# Altium schematic sheet H-00488 - Connectors Downstream.SchDoc: Connectors Downstream
size 403 x 281 mm; DocumentNumber: 12; SheetNumber: 12; SheetTotal: 12
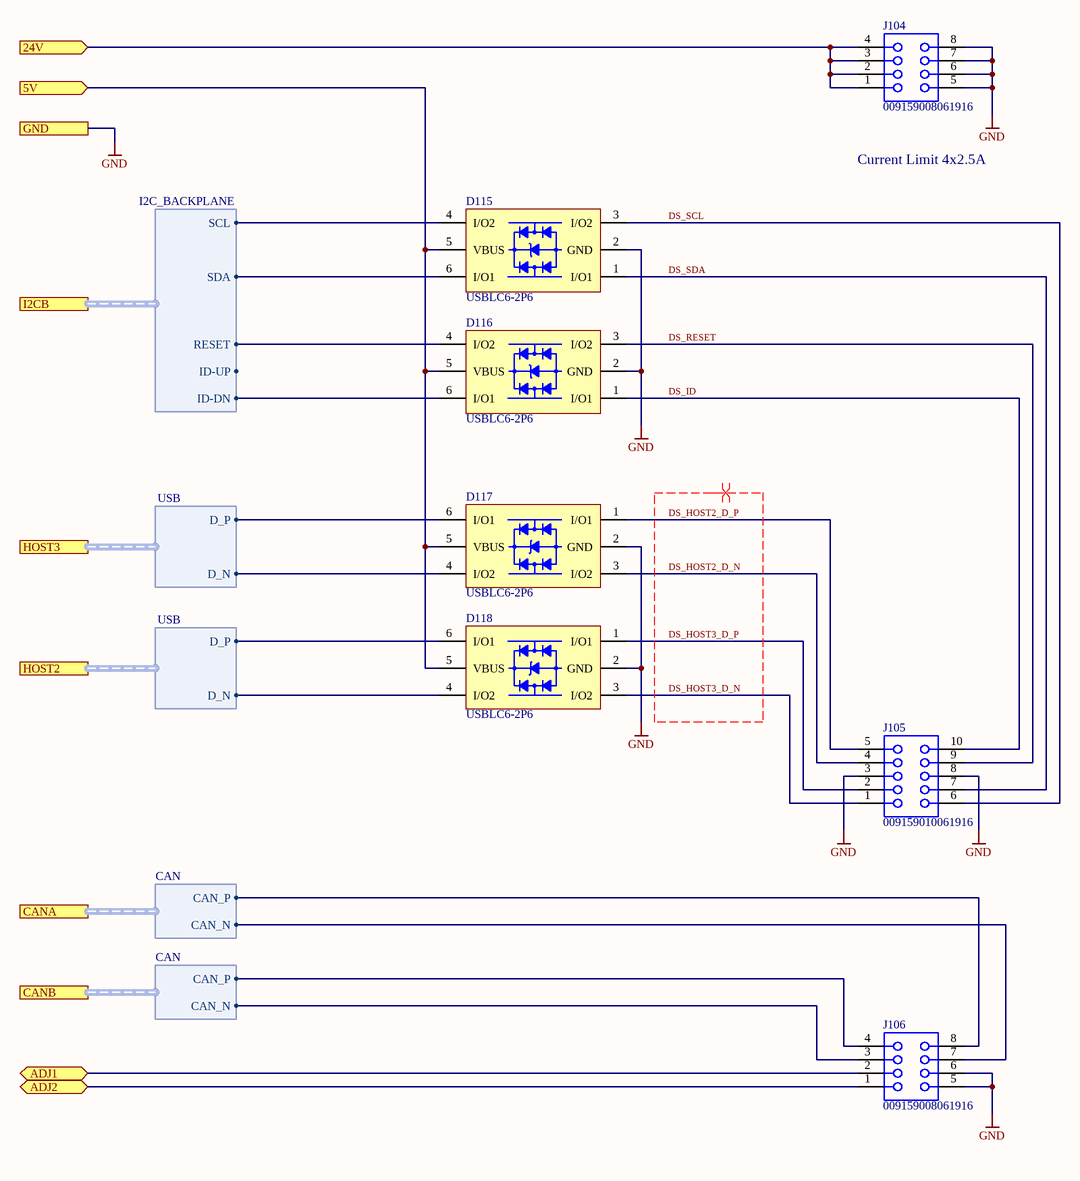
[diagram p0: H-00488 - Connectors Downstream.SchDoc]

## Parts
D115  USBLC6-2P6  [DIOSOFL6P50_160X160X95L29X26]
D116  USBLC6-2P6  [DIOSOFL6P50_160X160X95L29X26]
D117  USBLC6-2P6  [DIOSOFL6P50_160X160X95L29X26]
D118  USBLC6-2P6  [DIOSOFL6P50_160X160X95L29X26]
J104  009159008061916  [AVX_00-9159-008]
J105  009159010061916  [AVX_00-9159-010]
J106  009159008061916  [AVX_00-9159-008]

## Ports
5V (in), 24V (in), ADJ1 (bidir), ADJ2 (bidir), CANA (harness CAN), CANB (harness CAN), GND, HOST2 (harness USB), HOST3 (harness USB), I2CB (harness I2C_BACKPLANE)

## Harnesses
I2C_BACKPLANE: SDA, SCL, ID-UP, RESET, ID-DN
USB: D_P, D_N
CAN: CAN_N, CAN_P

## Nets
GND: D115.2(GND) D116.2(GND) D117.2(GND) D118.2(GND) J104.5 J104.6 J104.7 J104.8 J105.3 J105.8 J106.5 J106.6 ; port GND
5V: D115.5(VBUS) D116.5(VBUS) D117.5(VBUS) D118.5(VBUS) ; port 5V
24V: J104.1 J104.2 J104.3 J104.4 ; port 24V
ADJ1: J106.2 ; port ADJ1
ADJ2: J106.1 ; port ADJ2
DS_HOST2_D_N: D117.3(I/O2) J105.4
DS_HOST2_D_P: D117.1(I/O1) J105.5
DS_HOST3_D_N: D118.3(I/O2) J105.1
DS_HOST3_D_P: D118.1(I/O1) J105.2
DS_ID: D116.1(I/O1) J105.10
DS_RESET: D116.3(I/O2) J105.9
DS_SCL: D115.3(I/O2) J105.6
DS_SDA: D115.1(I/O1) J105.7
NetD115_4: D115.4(I/O2) ; port I2CB.SCL
NetD115_6: D115.6(I/O1) ; port I2CB.SDA
NetD116_4: D116.4(I/O2) ; port I2CB.RESET
NetD116_6: D116.6(I/O1) ; port I2CB.ID-DN
NetD117_4: D117.4(I/O2) ; port HOST3.D_N
NetD117_6: D117.6(I/O1) ; port HOST3.D_P
NetD118_4: D118.4(I/O2) ; port HOST2.D_N
NetD118_6: D118.6(I/O1) ; port HOST2.D_P
NetJ106_3: J106.3 ; port CANB.CAN_N
NetJ106_4: J106.4 ; port CANB.CAN_P
NetJ106_7: J106.7 ; port CANA.CAN_N
NetJ106_8: J106.8 ; port CANA.CAN_P

## Layout directives
differential pair; differential pair class DIFF_USB_EXT: DS_HOST2_D_N, DS_HOST2_D_P, DS_HOST3_D_N, DS_HOST3_D_P

## Notes on the sheet
- Current Limit 4x2.5A
- PROJECT
- DESCRIPTION
- SIZE
- ENGINEER
- VARIANT
- A3
- TITLE
- MODIFIED
- RELEASE
- HIBER BV
  MOERMANSKKADE 600
  1013 BC, AMSTERDAM
  THE NETHERLANDS
- FILE NAME
- APPROVER
- SHEET
- APPROVED
- OF
- THIS DOCUMENT AND THE DATA DISCLOSED HEREIN OR HEREWITH IS THE PROPERTY OF HIBER INTERNATIONAL BV. IT CONTAINS CONFIDENTIAL AND PROPRIETARY INFORMATION THAT CANNOT BE REPRODUCED OR DIVULGED, IN WHOLE OR IN PART, WITHOUT WRITTEN AUTHORIZATION.

## Library data of the parts
D115-D118 = CMP-00780-2: TVS DIODE 5.25VWM 17VC SOT666; Reverse Breakdown Voltage: 6V; ESD Protection: Yes; Max Reverse Leakage Current: 150nA; Number of Elements: 1; Clamping Voltage: 17V; Direction: Bidirectional, Unidirectional; Capacitance: 3.5pF; Working Voltage: 5V; Number of Channels: 2; Test Current: 1mA; Peak Pulse Current: 5A; Element Configuration: Dual; Qualification: Standard; Max Operating Temperature: 125°C; Lead Free: Lead Free; Contact Plating: Matte, Tin; Package Quantity: 1; Case/Package: SOT-666; Min Operating Temperature: -40°C; Length: 1.7mm; Breakdown Voltage: 6V; Packaging: Tape and Reel; REACH SVHC: No SVHC; Termination: SMD/SMT; Mount: Surface Mount; Power Line Protection: Yes; Radiation Hardening: No; RoHS: Yes; Leakage Current: 150nA; Polarity: Bidirectional, Unidirectional; Depth: 1.3mm; Number of Bidirectional Channels: 2; Number of Pins: 6; Height: 0.6mm; Reverse Standoff Voltage: 5V; Width: 1.3mm; Min Breakdown Voltage: 6V; Operating Supply Voltage: 5V; Max Breakdown Voltage: 6V
J104 J106 = CMP-01083-5: CONN SSL BRIDGE 8POS 2MM; RoHS: Yes; Mount: TH
J105 = CMP-01075-4: AVX INTERCONNECT - 009159010061916 - CARD EDGE CONN, DUAL SIDE, 10POS, SMD; RoHS: Yes; Mount: TH